# Altium schematic sheet Sheet6.SchDoc
size A3
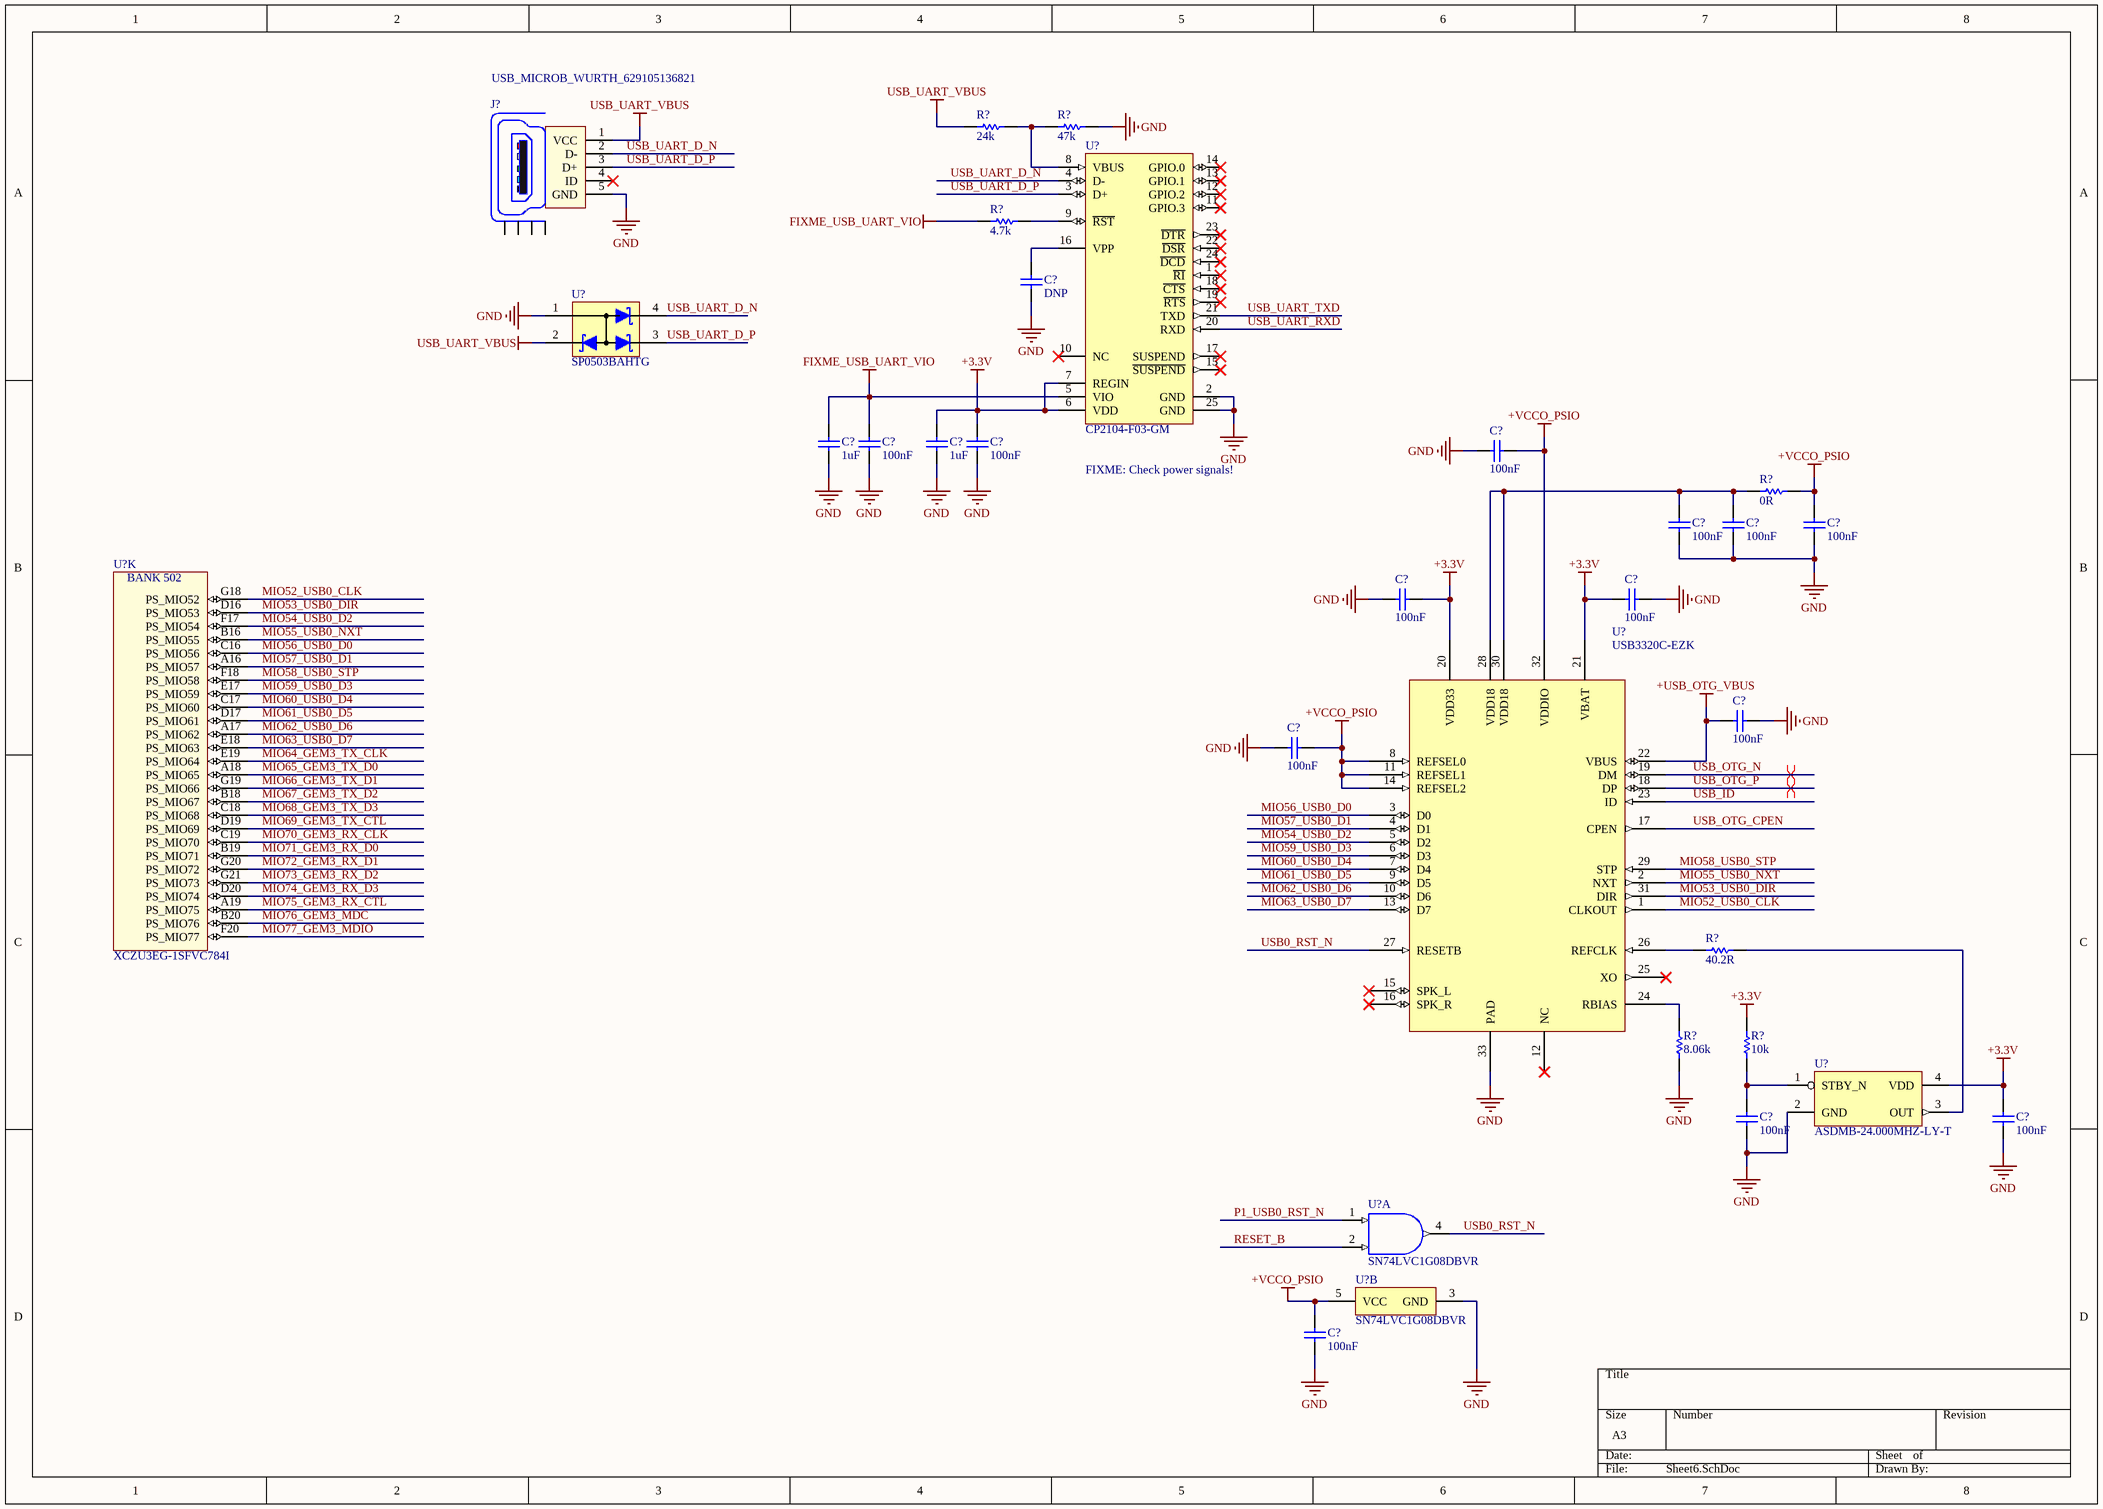
[diagram p0: Sheet6.SchDoc]

## Parts
(Parts that share a designator on the sheet are numbered #1, #2 ... from top to bottom, then left to right.)
C?#1  DNP  [CAPC1005L_0402]
C?#2  1uF  [CAPC1005L_0402]
C?#3  100nF  [CAPC1005L_0402]
C?#4  1uF  [CAPC1005L_0402]
C?#5  100nF  [CAPC1005L_0402]
C?#6  100nF  [CAPC1005L_0402]
C?#7  100nF  [CAPC1005L_0402]
C?#8  100nF  [CAPC1005L_0402]
C?#9  100nF  [CAPC1005L_0402]
C?#10  100nF  [CAPC1005L_0402]
C?#11  100nF  [CAPC1005L_0402]
C?#12  100nF  [CAPC1005L_0402]
C?#13  100nF  [CAPC1005L_0402]
C?#14  100nF  [CAPC1005L_0402]
C?#15  100nF  [CAPC1005L_0402]
C?#16  100nF  [CAPC1005L_0402]
J?  USB_MICROB_WURTH_629105136821  [USB_MICROB_WURTH_629105136821]
R?#1  value 24k  [RESC1005L_0402]  (hidden comment: RES0402_24K_0W1)
R?#2  value 47k  [RESC1005L_0402]  (hidden comment: RES0402_47K_0W1)
R?#3  value 4.7k  [RESC1005L_0402]  (hidden comment: RES0402_4K7_0W1_1T)
R?#4  value 0R  [RESC1005L_0402]  (hidden comment: RES0402_0R_0W1)
R?#5  value 40.2R  [RESC1005L_0402]  (hidden comment: RES0402_40R2_0W1_1T)
R?#6  value 8.06k  [RESC1005L_0402]  (hidden comment: RES0402_8K06_0W1_1T)
R?#7  value 10k  [RESC1005L_0402]  (hidden comment: RES0402_10K_0W1_05T)
U?#1  CP2104-F03-GM  [SLAB-QFN-24-2675x2675TP_L]
U?#2  SP0503BAHTG  [SP0503BAHT_SOT143]
U?#3  XCZU3EG-1SFVC784I  [BGA784x28]  (part K of 22)
U?#4  USB3320C-EZK  [QFN50P500X500X100_HS-33N]
U?#5  ASDMB-24.000MHZ-LY-T  [ASDMB]
U?#6  SN74LVC1G08DBVR  [DBV0005A_N]  (part A of 2)
U?#7  SN74LVC1G08DBVR  [DBV0005A_N]  (part B of 2)

## Nets
+3.3V: C?#4.1 C?#5.1 C?#10.2 C?#11.2 C?#15.1 R?#7.1 U?#1.6(VDD) U?#1.7(REGIN) U?#4.20(VDD33) U?#4.21(VBAT) U?#5.4(VDD)
+USB_OTG_VBUS: C?#12.1 U?#4.22(VBUS)
+VCCO_PSIO: C?#6.2 C?#9.2 C?#13.2 C?#16.1 R?#4.2 U?#4.8(REFSEL0) U?#4.11(REFSEL1) U?#4.14(REFSEL2) U?#4.32(VDDIO) U?#7.5(VCC)
FIXME_USB_UART_VIO: C?#2.1 C?#3.1 R?#3.1 U?#1.5(VIO)
GND: C?#1.2 C?#2.2 C?#3.2 C?#4.2 C?#5.2 C?#6.1 C?#7.2 C?#8.1 C?#9.1 C?#10.1 C?#11.1 C?#12.2 C?#13.1 C?#14.2 C?#15.2 C?#16.2 J?.5(GND) R?#2.2 R?#6.2 U?#1.2(GND) U?#1.25(GND) U?#2.1 U?#4.33(PAD) U?#5.2(GND) U?#7.3(GND)
USB_UART_VBUS: J?.1(VCC) R?#1.1 U?#2.2
MIO52_USB0_CLK: U?#3.G18(PS_MIO52) U?#4.1(CLKOUT)
MIO53_USB0_DIR: U?#3.D16(PS_MIO53) U?#4.31(DIR)
MIO54_USB0_D2: U?#3.F17(PS_MIO54) U?#4.5(D2)
MIO55_USB0_NXT: U?#3.B16(PS_MIO55) U?#4.2(NXT)
MIO56_USB0_D0: U?#3.C16(PS_MIO56) U?#4.3(D0)
MIO57_USB0_D1: U?#3.A16(PS_MIO57) U?#4.4(D1)
MIO58_USB0_STP: U?#3.F18(PS_MIO58) U?#4.29(STP)
MIO59_USB0_D3: U?#3.E17(PS_MIO59) U?#4.6(D3)
MIO60_USB0_D4: U?#3.C17(PS_MIO60) U?#4.7(D4)
MIO61_USB0_D5: U?#3.D17(PS_MIO61) U?#4.9(D5)
MIO62_USB0_D6: U?#3.A17(PS_MIO62) U?#4.10(D6)
MIO63_USB0_D7: U?#3.E18(PS_MIO63) U?#4.13(D7)
MIO64_GEM3_TX_CLK: U?#3.E19(PS_MIO64)
MIO65_GEM3_TX_D0: U?#3.A18(PS_MIO65)
MIO66_GEM3_TX_D1: U?#3.G19(PS_MIO66)
MIO67_GEM3_TX_D2: U?#3.B18(PS_MIO67)
MIO68_GEM3_TX_D3: U?#3.C18(PS_MIO68)
MIO69_GEM3_TX_CTL: U?#3.D19(PS_MIO69)
MIO70_GEM3_RX_CLK: U?#3.C19(PS_MIO70)
MIO71_GEM3_RX_D0: U?#3.B19(PS_MIO71)
MIO72_GEM3_RX_D1: U?#3.G20(PS_MIO72)
MIO73_GEM3_RX_D2: U?#3.G21(PS_MIO73)
MIO74_GEM3_RX_D3: U?#3.D20(PS_MIO74)
MIO75_GEM3_RX_CTL: U?#3.A19(PS_MIO75)
MIO76_GEM3_MDC: U?#3.B20(PS_MIO76)
MIO77_GEM3_MDIO: U?#3.F20(PS_MIO77)
P1_USB0_RST_N: U?#6.1(A)
RESET_B: U?#6.2(B)
USB0_RST_N: U?#4.27(RESETB) U?#6.4(Y)
USB_ID: U?#4.23(ID)
USB_OTG_CPEN: U?#4.17(CPEN)
USB_OTG_N: U?#4.19(DM)
USB_OTG_P: U?#4.18(DP)
USB_UART_D_N: J?.2(D-) U?#1.4(D-) U?#2.4
USB_UART_D_P: J?.3(D+) U?#1.3(D+) U?#2.3
USB_UART_RXD: U?#1.20(RXD)
USB_UART_TXD: U?#1.21(TXD)
NetC?#1_1: C?#1.1 U?#1.16(VPP)
NetC?#7_1: C?#7.1 C?#8.2 R?#4.1 U?#4.28(VDD18) U?#4.30(VDD18)
NetC?#14_1: C?#14.1 R?#7.2 U?#5.1(STBY_N)
NetR?#1_2: R?#1.2 R?#2.1 U?#1.8(VBUS)
NetR?#3_2: R?#3.2 U?#1.9(~{RST})
NetR?#5_1: R?#5.1 U?#4.26(REFCLK)
NetR?#5_2: R?#5.2 U?#5.3(OUT)
NetR?#6_1: R?#6.1 U?#4.24(RBIAS)

Not connected (* = marked no-connect by the designer): J? 4(ID)* Z1(Shield) Z2(Shield) Z3(Shield) Z4(Shield); U?#1 1(~{RI})* 10(NC)* 11(GPIO.3)* 12(GPIO.2)* 13(GPIO.1)* 14(GPIO.0)* 15(~{SUSPEND})* 17(SUSPEND)* 18(~{CTS})* 19(~{RTS})* 22(~{DSR})* 23(~{DTR})* 24(~{DCD})*; U?#4 12(NC)* 15(SPK_L)* 16(SPK_R)* 25(XO)*

## Layout directives
differential pair: USB_OTG_N, USB_OTG_P

## Notes on the sheet
- FIXME: Check power signals!
- (in symbol XCZU3EG-1SFVC784I, part K) BANK 502

## Library data of the parts
C?#1 = CAPCER0402: 0402 Package Cap Footprint; Package: 0402; ComponentLink1Description: Datasheet; Value: DNP
C?#2 C?#4 = CAPCER0402X5R1U16V_20T: CAP CER 1UF 16V X5R 0402; Manufacturer 1: Murata Electronics North America; Manufacturer Part Number 1: GRM155R61C105ME01D; Tolerance: 20%; Package: 0402; ComponentLink1Description: Datasheet; Value: 1uF; Voltage: 16V; Temperature Coefficient: X5R; Supplier 1: Digi-Key; Supplier Part Number 1: 490-10454-1-ND; Operating Temperature: -55°C ~ 85°C
C?#3 C?#5-C?#16 = CAPCER0402X7R100N25V_10T: CAP CER 0.1UF 25V X7R 0402; Manufacturer 1: Murata Electronics North America; Manufacturer Part Number 1: GRM155R71E104KE14D; Tolerance: 10%; Package: 0402; ComponentLink1Description: Datasheet; Value: 100nF; Voltage: 25V; Temperature Coefficient: X7R; Supplier 1: Digi-Key; Supplier Part Number 1: 490-10698-1-ND; Operating Temperature: -55°C ~ 125°C
J? = USB_MICROB_WURTH_629105136821: CONN RCPT USB MICRO B R/A SMT; Manufacturer 1: Wurth Electronics Inc; Number of Contacts: 5; Opearating Temperature: -40°C ~ 105°C; ComponentLink1Description: Datasheet; ComponentLink1URL: C:\Users\Public\Documents\Altium\AD16\Library\PDF\629105136821.pdf; Supplier 1: Digi-Key; Manufacturer Part Number 1: 629105136821; Supplier Part Number 1: 732-3155-1-ND
R?#1 = RES0402_24K_0W1: RES SMD 24K OHM 1% 1/10W 0402; Manufacturer 1: Panasonic Electronic Components; Manufacturer Part Number 1: ERJ-2RKF2402X; Package: 0402; ComponentLink1Description: Datasheet; Power: 1/10W; Tolerance: 1%; Supplier 1: Digi-Key; Supplier Part Number 1: P24.0KLCT-ND
R?#2 = RES0402_47K_0W1: RES SMD 47K OHM 1% 1/10W 0402; Manufacturer 1: Panasonic Electronic Components; Manufacturer Part Number 1: ERJ-2RKF4702X; Package: 0402; ComponentLink1Description: Datasheet; Power: 1/10W; Tolerance: 1%; Supplier 1: Digi-Key; Supplier Part Number 1: P47.0KLCT-ND
R?#3 = RES0402_4K7_0W1_1T: RES SMD 4.7K OHM 1% 1/10W 0402; Manufacturer 1: Panasonic Electronic Components; Manufacturer Part Number 1: ERJ-2RKF4701X; Package: 0402; ComponentLink1Description: Datasheet; Power: 1/10W; Tolerance: 1%; Supplier 1: Digi-Key; Supplier Part Number 1: P4.70KLCT-ND
R?#4 = RES0402_0R_0W1: RES SMD 0 OHM JUMPER 1/10W 0402; Manufacturer 1: Panasonic Electronic Components; Manufacturer Part Number 1: ERJ-2GE0R00X; Package: 0402; ComponentLink1Description: Datasheet; Power: 1/10W; Tolerance: -; Supplier 1: Digi-Key; Supplier Part Number 1: P0.0JCT-ND
R?#5 = RES0402_40R2_0W1_1T: RES SMD 40.2 OHM 1% 1/10W 0402; Manufacturer 1: Panasonic Electronic Components; Manufacturer Part Number 1: ERJ-2RKF40R2X; Package: 0402; ComponentLink1Description: Datasheet; Power: 1/10W; Tolerance: 1%; Supplier 1: Digi-Key; Supplier Part Number 1: P40.2LCT-ND
R?#6 = RES0402_8K06_0W1_1T: RES SMD 8.06K OHM 1% 1/10W 0402; Manufacturer 1: Panasonic Electronic Components; Manufacturer Part Number 1: ERJ-2RKF8061X; Package: 0402; ComponentLink1Description: Datasheet; Power: 1/10W; Tolerance: 1%; Supplier 1: Digi-Key; Supplier Part Number 1: P8.06KLCT-ND
R?#7 = RES0402_10K_0W1_05T: RES SMD 10K OHM 0.5% 1/16W 0402; Manufacturer 1: Panasonic Electronic Components; Manufacturer Part Number 1: ERJ-2RHD1002X; Package: 0402; ComponentLink1Description: Datasheet; Power: 1/16W; Tolerance: 0.5%; Supplier 1: Digi-Key; Supplier Part Number 1: P15984CT-ND
U?#1 = CP2104-F03-GM: Single-Chip USB to UART Bridge, 4 Dig I/O Pins, Internal Oscillator, 1024 Bytes EEPROM, -40 to 85 degC, 24-pin QFN; Manufacturer 1: Silicon Labs; Internal Oscillator: TRUE; Sub-Family: USB Bridges; DatasheetVersion: Rev. 1.0; PackageReference: QFN-24; PackageDescription: 24-Pin Quad-Flat No-Leads Package, Body 4 x 4 mm, Pitch 0.5 mm; Supplier 1: Digi-Key; Supplier Part Number 1: 336-2008-5-ND; Supplier 2: Mouser; Supplier Part Number 2: 634-CP2104-F03-GM; EEPROM: 1024 Bytes; Mounting Technology: Surface Mount; Code_JEDEC: MO-220; Code_IPC: J-STD-020; Manufacturer Part Number 1: CP2104-F03-GM; ComponentLink1Description: Manufacturer URL; ComponentLink1URL: http://www.silabs.com/; ComponentLink2Description: Datasheet; ComponentLink2URL: C:\Users\Public\Documents\Altium\AD16\Library\PDF\cp2104.pdf; ComponentLink3Description: Package Specification; ComponentLink3URL: http://www.silabs.com/Support%20Documents/TechnicalDocs/C8051F93x-92x.pdf; Operating Temperature: -40°C ~ 85°C
U?#2 = SP0503BAHTG: IC TXRX USB 2.0 FLEXPWR 32QFN; Manufacturer 1: Littelfuse Inc.; ComponentLink1Description: Datasheet; ComponentLink1URL: C:\Users\Public\Documents\Altium\AD16\Library\PDF\SP05xxBA.pdf; Supplier 1: Digi-Key; Supplier Part Number 1: F2715CT-ND; Manufacturer Part Number 1: SP0503BAHTG; Operating Temperature: -40°C ~ 85°C (TA)
U?#3 = XCZU3EG-1SFVC784I: IC FPGA 252 I/O 784FCBGA - XILINX ZYNQ ULTRASCALE+; Manufacturer 1: Xilinx Inc.; Package: SFVC784; ComponentLink1Description: Datasheet; Supplier 1: Digi-Key; Supplier Part Number 1: XCZU3EG-1SFVC784I-ND; Manufacturer Part Number 1: XCZU3EG-1SFVC784I
U?#4 = USB3320C-EZK: IC TXRX USB 2.0 FLEXPWR 32QFN; Manufacturer 1: Microchip Technology; ComponentLink1Description: Datasheet; ComponentLink1URL: C:\Users\Public\Documents\Altium\AD16\Library\PDF\00001792E.pdf; Supplier 1: Digi-Key; Supplier Part Number 1: USB3320C-EZK-ND; Manufacturer Part Number 1: USB3320C-EZK; Operating Temperature: -40°C ~ 85°C
U?#5 = ASDMB-24.000MHZ-LY-T: OSC MEMS 24.000MHZ CMOS SMD; Manufacturer 1: Abracon LLC; Frequency: 24MHz; Frequency Stability: ±10ppm; ComponentLink1Description: Datasheet; ComponentLink1URL: C:\Users\Public\Documents\Altium\AD16\Library\PDF\ASDMB.pdf; Supplier 1: Digi-Key; Supplier Part Number 1: 535-11186-1-ND; Manufacturer Part Number 1: ASDMB-24.000MHZ-LY-T; Operating Temperature: -40°C ~ 85°C
U?#6 U?#7 = SN74LVC1G08DBVR: Single 2-Input Positive-AND Gate, DBV0005A, LARGE T&R; Manufacturer 1: Texas Instruments; VCC(Min)(V): 1.65; VCC(Max)(V): 5.5; Output Type: CMOS; ICC @ Nom Voltage(Max)(mA): 0.01; Input Type: CMOS/TTL; Bits(#): 1; F @ Nom Voltage(Max)(Mhz): 150; Rating: Catalog; Technology Family: LVC; Voltage(Nom)(V): 1.8,2.5,3.3,5; Schmitt Trigger: No; Output Drive (IOL/IOH)(Max)(mA): 32/-32; tpd @ Nom Voltage(Max)(ns): 4.5,6,4,5; Logic: True; Gate Type: AND; DatasheetVersion: SCES217Y; PackageReference: DBV0005A; Supplier 2: Mouser; Supplier Part Number 2: 595-SN74LVC1G08DBVR; Supplier 1: Digi-Key; Supplier Part Number 1: 296-11601-2-ND; Supplier 3: Digi-Key; Supplier Part Number 3: 296-11601-1-ND; Supplier 4: Digi-Key; Supplier Part Number 4: 296-11601-6-ND; Generic Part Number: SN74LVC1G08; Operating Temperature: -40°C ~ 125°C; Sub-Family: AND Gate; 3-State Output: No; Manufacturer Part Number 1: SN74LVC1G08DBVR; ComponentLink1Description: Manufacturer URL; ComponentLink1URL: C:\Users\Public\Documents\Altium\AD16\Library\PDF\sn74lvc1g08.pdf